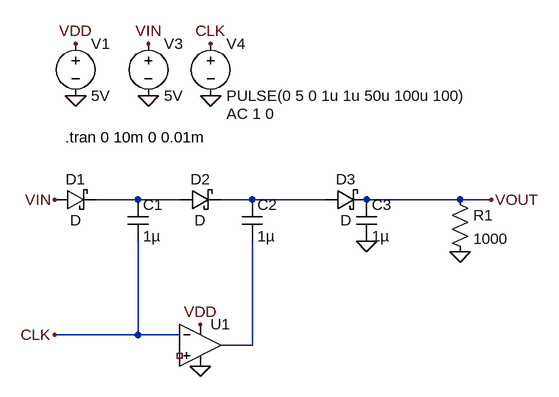
[diagram p0: schematic BAI 7 CHUAN BI 2.asc]
BAI 7 CHUAN BI 2.asc, the LTspice schematic file:
Version 4.1
SHEET 1 1472 680
WIRE 96 336 32 336
WIRE 160 336 96 336
WIRE 272 336 224 336
WIRE 384 336 272 336
WIRE 592 336 448 336
WIRE 640 336 592 336
WIRE 96 544 96 400
WIRE 96 544 -32 544
WIRE 160 544 96 544
WIRE 272 560 272 400
WIRE 272 560 224 560
FLAG 0 96 VDD
FLAG 112 96 VIN
FLAG 208 96 CLK
FLAG 208 176 0
FLAG 112 176 0
FLAG 0 176 0
FLAG -32 336 VIN
FLAG 640 336 VOUT
FLAG -32 544 CLK
FLAG 448 400 0
FLAG 192 528 VDD
FLAG 592 416 0
FLAG 192 592 0
SYMBOL voltage 0 80 R0
SYMATTR InstName V1
SYMATTR Value 5V
SYMBOL voltage 112 80 R0
SYMATTR InstName V3
SYMATTR Value 5V
SYMBOL voltage 208 80 R0
WINDOW 123 24 124 Left 2
WINDOW 39 0 0 Left 0
SYMATTR Value2 AC 1 0
SYMATTR InstName V4
SYMATTR Value PULSE(0 5 0 1u 1u 50u 100u 100)
SYMBOL cap 80 336 R0
SYMATTR InstName C1
SYMATTR Value 1µ
SYMBOL cap 256 336 R0
SYMATTR InstName C2
SYMATTR Value 1µ
SYMBOL cap 432 336 R0
SYMATTR InstName C3
SYMATTR Value 1µ
SYMBOL schottky -32 352 R270
WINDOW 0 32 32 VTop 2
WINDOW 3 0 32 VBottom 2
SYMATTR InstName D1
SYMBOL schottky 160 352 R270
WINDOW 0 32 32 VTop 2
WINDOW 3 0 32 VBottom 2
SYMATTR InstName D2
SYMBOL schottky 384 352 R270
WINDOW 0 32 32 VTop 2
WINDOW 3 0 32 VBottom 2
SYMATTR InstName D3
SYMBOL res 576 320 R0
SYMATTR InstName R1
SYMATTR Value 1000
SYMBOL OpAmps\\UniversalOpAmp2 192 560 R0
SYMATTR InstName U1
TEXT -16 240 Left 2 !.tran 0 10m 0 0.01m

The netlist it stands for:
* BAI 7 CHUAN BI 2.asc
V1 VDD 0 5V
V3 VIN 0 5V
V4 CLK 0 PULSE(0 5 0 1u 1u 50u 100u 100) AC 1 0
C1 N001 CLK 1µ
C2 N002 N003 1µ
C3 VOUT 0 1µ
D1 VIN N001 D
D2 N001 N002 D
D3 N002 VOUT D
R1 VOUT 0 1000
X§U1 NC_01 CLK VDD 0 N003 level2 Avol=1Meg GBW=10Meg Slew=10Meg Ilimit=25m Rail=0 Vos=0 En=0 Enk=0 In=0 Ink=0 Rin=500Meg  ; pins In+ In- V+ V- OUT
.model D D
.lib standard.dio
.tran 0 10m 0 0.01m
.lib UniversalOpAmp2.lib
.backanno
.end